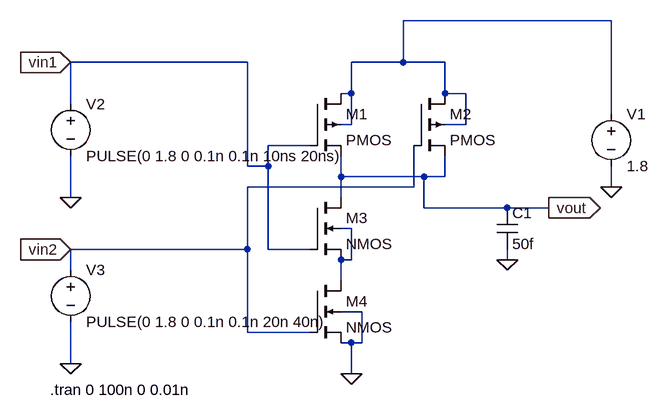
[diagram p0: schematic nand180.asc]
nand180.asc, the LTspice schematic file:
Version 4.1
SHEET 1 896 680
WIRE 624 -96 304 -96
WIRE 64 -32 -208 -32
WIRE 304 -32 304 -96
WIRE 304 -32 224 -32
WIRE 368 -32 304 -32
WIRE 224 16 224 -32
WIRE 224 16 208 16
WIRE 368 16 368 -32
WIRE 400 16 368 16
WIRE -208 32 -208 -32
WIRE 624 48 624 -96
WIRE 224 64 224 16
WIRE 224 64 208 64
WIRE 400 64 400 16
WIRE 400 64 368 64
WIRE 160 96 96 96
WIRE 64 128 64 -32
WIRE 96 128 96 96
WIRE 96 128 64 128
WIRE 208 144 208 112
WIRE 336 144 208 144
WIRE 368 144 368 112
WIRE 368 144 336 144
WIRE 320 160 320 96
WIRE 320 160 64 160
WIRE 624 160 624 128
WIRE -208 176 -208 112
WIRE 208 176 208 144
WIRE 336 192 336 144
WIRE 464 192 336 192
WIRE 528 192 464 192
WIRE 224 224 208 224
WIRE 64 256 64 160
WIRE 64 256 -208 256
WIRE 96 256 96 128
WIRE 160 256 96 256
WIRE 224 272 224 224
WIRE 224 272 208 272
WIRE 464 272 464 256
WIRE -208 288 -208 256
WIRE 208 304 208 272
WIRE 240 352 208 352
WIRE 64 384 64 256
WIRE 160 384 64 384
WIRE 224 400 208 400
WIRE 240 400 240 352
WIRE 240 400 224 400
WIRE -208 432 -208 368
WIRE 224 448 224 400
FLAG 224 448 0
FLAG 624 160 0
FLAG -208 176 0
FLAG -208 432 0
FLAG -208 -32 vin1
IOPIN -208 -32 In
FLAG -208 256 vin2
IOPIN -208 256 In
FLAG 464 272 0
FLAG 528 192 vout
IOPIN 528 192 Out
SYMBOL pmos4 160 16 R0
SYMATTR InstName M1
SYMATTR Value2 l=180n w=810n
SYMBOL pmos4 320 16 R0
SYMATTR InstName M2
SYMATTR Value2 l=180n w=810n
SYMBOL nmos4 160 176 R0
SYMATTR InstName M3
SYMATTR Value2 l=180n w=270n
SYMBOL nmos4 160 304 R0
SYMATTR InstName M4
SYMATTR Value2 l=180n w=270n
SYMBOL voltage 624 32 R0
WINDOW 123 0 0 Left 0
WINDOW 39 0 0 Left 0
SYMATTR InstName V1
SYMATTR Value 1.8
SYMBOL voltage -208 16 R0
WINDOW 123 0 0 Left 0
WINDOW 39 0 0 Left 0
SYMATTR InstName V2
SYMATTR Value PULSE(0 1.8 0 0.1n 0.1n 10ns 20ns)
SYMBOL voltage -208 272 R0
WINDOW 123 0 0 Left 0
WINDOW 39 0 0 Left 0
SYMATTR InstName V3
SYMATTR Value PULSE(0 1.8 0 0.1n 0.1n 20n 40n)
SYMBOL cap 448 192 R0
SYMATTR InstName C1
SYMATTR Value 50f
TEXT -240 472 Left 2 !.tran 0 100n 0 0.01n

The netlist it stands for:
* nand180.asc
M1 N001 vin1 vout N001 PMOS l=180n w=810n
M2 N001 vin2 vout N001 PMOS l=180n w=810n
M3 vout vin1 N002 N002 NMOS l=180n w=270n
M4 N002 vin2 0 0 NMOS l=180n w=270n
V1 N001 0 1.8
V2 vin1 0 PULSE(0 1.8 0 0.1n 0.1n 10ns 20ns)
V3 vin2 0 PULSE(0 1.8 0 0.1n 0.1n 20n 40n)
C1 vout 0 50f
.model NMOS NMOS
.model PMOS PMOS
.lib standard.mos
.tran 0 100n 0 0.01n
.backanno
.end